# EasyEDA Pro project ProPrj_HTXStudio_OneHanded_Keyboard.epro, board 方向按键
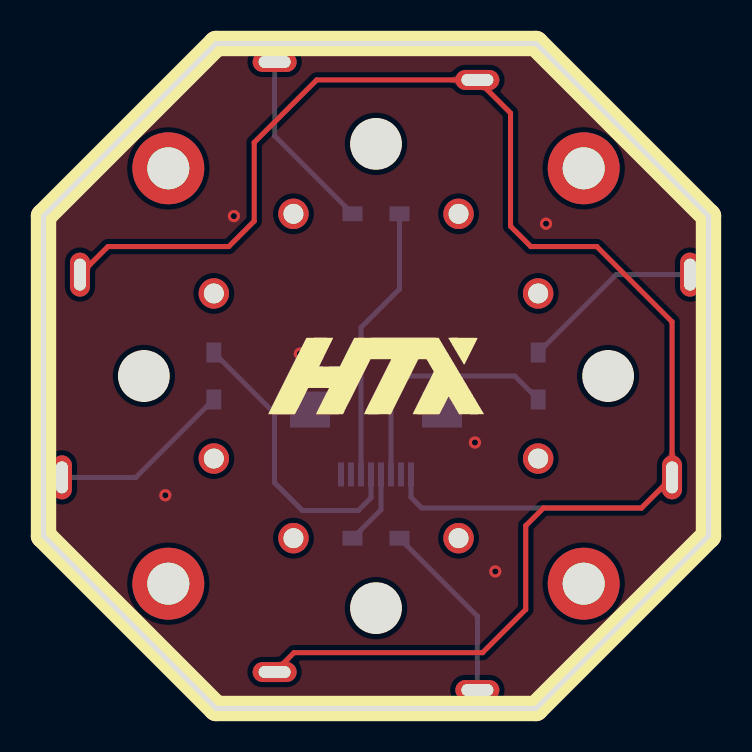
[diagram p10: board, top side]
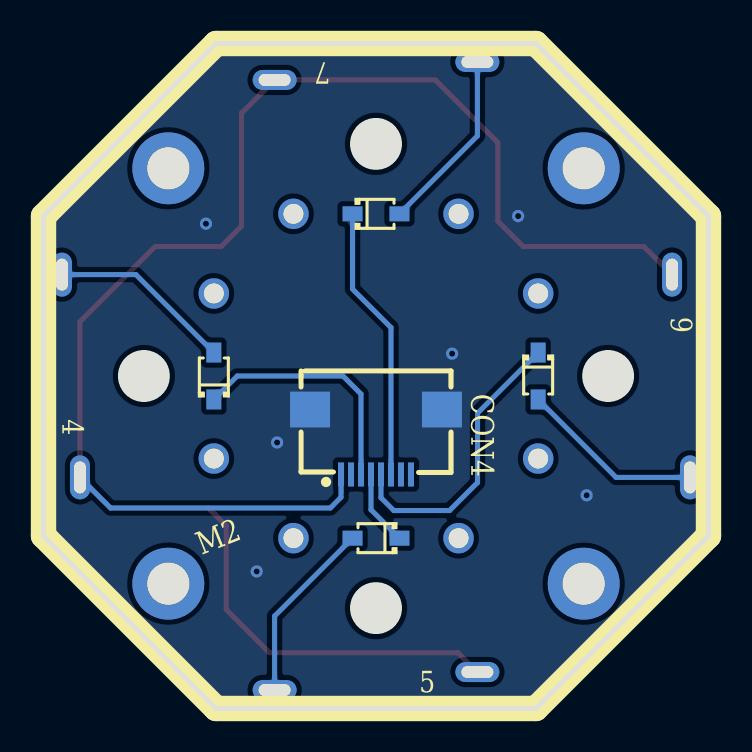
[diagram p11: board, bottom side, seen from below]

Outline 33.27 x 33.27 mm; copper layers: Top Layer, Bottom Layer. Coordinates in mm from the lower left corner of the outline.
Outline path: 0,24.64 0,8.64 8.64,0 24.64,0 33.27,8.64 33.27,24.64 24.64,33.27 8.64,33.27 0,24.64
Stack: Top Layer 0.035mm / Dielectric1 1.51mm FR4 er 4.5 / Bottom Layer 0.035mm

## Design rules (mm)
template: 自定义配置
spacing copperThickness1oz (default): track to track 0.102, other pairs 0.152 to 0.3
spacing copperThickness2oz: track to track 0.203, other pairs 0.152 to 0.3
track width copperThickness1oz (default): min 0.127, default 0.254, max 2.54
track width copperThickness2oz: min 0.203, default 0.254, max 2.54
differential pair differentialPair (default): width min 0.127, default 0.254, max 2.54; gap min 0.152, default 0.152
via viaSize (default): diameter min 0.5, default 0.61, max 10; hole min 0.3, default 0.305, max 6.3

## Placement (name value [footprint] x y rotation side)
D59  1N4148WS  [SOD-323_L1.8-W1.3-LS2.5-RD]  24.75 16.64 90 bottom
D60  1N4148WS  [SOD-323_L1.8-W1.3-LS2.5-RD]  16.64 8.52 0 bottom
D61  1N4148WS  [SOD-323_L1.8-W1.3-LS2.5-RD]  8.52 16.64 270 bottom
D62  1N4148WS  [SOD-323_L1.8-W1.3-LS2.5-RD]  16.64 24.75 180 bottom
FPC7  FPC-05FB-8PH20  [FPC-SMD_8P-P0.50_XUNPU_FPC-05FB-8PH20]  16.64 13.33 0 bottom
K18  -  [ALPS_键盘轴]  16.64 24.75 180 top
K19  -  [ALPS_键盘轴]  8.52 16.64 270 top
K20  -  [ALPS_键盘轴]  16.64 8.52 0 top
K21  -  [ALPS_键盘轴]  24.75 16.64 90 top
NOREF  -  [Pad_e52]  6.25 6.25 180 top
NOREF#2  -  [Pad_e48]  6.25 27.03 0 top
NOREF#3  -  [Pad_e53]  27.03 6.25 0 top
NOREF#4  -  [Pad_e51]  27.03 27.03 180 top

## Footprints (pads in the part's own frame, mm; a bottom-side part is the same pattern mirrored in y, then rotated)
ALPS_键盘轴
  round 1.524 hole 1: 1(-4.13,0) 1(4.13,0)
  oval 2.2x1 hole 1.6x0.6: 2(-5.073,-6.7) 3(5.073,-7.6)
FPC-SMD_8P-P0.50_XUNPU_FPC-05FB-8PH20
  rect 0.3x1.2 smd: 1(1.75,1.625) 2(1.25,1.625) 3(0.75,1.625) 4(0.25,1.625) 5(-0.25,1.625) 6(-0.75,1.625) 7(-1.25,1.625) 8(-1.75,1.625)
  rect 2x1.8 smd: 9(-3.3,-1.625) 10(3.3,-1.625)
Pad_e48
  round 3.6 hole 2.1: 1(0,0)
Pad_e51
  round 3.6 hole 2.1: 1(0,0)
Pad_e52
  round 3.6 hole 2.1: 1(0,0)
Pad_e53
  round 3.6 hole 2.1: 1(0,0)
SOD-323_L1.8-W1.3-LS2.5-RD
  rect 1x0.75 smd: 1(-1.173,0) 2(1.173,0)

## Nets
As in the schematic.

Pads without a net: K18 1; K19 1; K20 1; K21 1; NOREF 1; NOREF#2 1; NOREF#3 1; NOREF#4 1

## Via types
v1: diameter 0.61, hole 0.305, Top Layer to Bottom Layer, 6 vias

## Routing (per net, layer and track width the routed paths; a pad name or vN(x,y) marks a point on that pad's centre or on a via; arc(x,y) is an arc through that point)
GND:
  vias: v1(6.1,10.67) v1(9.53,24.64) v1(12.83,17.75) v1(21.59,13.31) v1(22.61,6.86) v1(25.15,24.26)
CCOL4: length 12.2
  Bottom Layer w0.254: FPC7.3 17.39,15.74 18.29,16.64 23.58,16.64 D59.1
CCOL5: length 3.8
  Bottom Layer w0.254: FPC7.4 16.89,9.95 D60.1
CCOL6: length 14.6
  Bottom Layer w0.254: D61.1 11.56,14.78 11.56,11.3 12.95,9.91 15.75,9.91 16.39,10.55 FPC7.5
CCOL7: length 13.8
  Bottom Layer w0.254: FPC7.6 15.89,19.06 17.81,20.98 D62.1
CROW6: length 93.5
  Top Layer w0.254: 1.82,21.71 3.23,23.11 9.27,23.11 10.54,24.38 10.54,28.32 13.67,31.45 K18.2 23.37,29.79 23.37,24.13 24.38,23.11 27.69,23.11 31.45,19.35 31.45,11.56 29.92,10.03 25.02,10.03 24.13,9.14 24.13,4.95 21.97,2.79 12.53,2.79 K20.2
  Bottom Layer w0.254: 31.45,11.56 29.92,10.03 18.92,10.03 18.39,10.57 FPC7.1
$1N260: length 9.2
  Bottom Layer w0.254: 32.35,21.71 28.65,21.71 D59.2
$1N299: length 9.2
  Bottom Layer w0.254: D60.2 21.71,4.62 K20.3
$1N338: length 9.2
  Bottom Layer w0.254: 0.92,11.56 4.62,11.56 D61.2
$1N377: length 9.2
  Bottom Layer w0.254: K18.3 11.56,28.65 D62.2

## Copper pours and planes (outline as drawn; the poured copper is in the pictures)
GND on Top Layer: 0,24.64 8.64,33.27 24.64,33.27 33.27,24.64 33.27,8.64 24.64,0 8.64,0 0,8.64
GND on Bottom Layer: 0,24.64 8.64,33.27 24.64,33.27 33.27,24.64 33.27,8.64 24.64,0 8.64,0 0,8.64

Small or netless copper shapes (teardrops, artwork), in the pictures only: 6 on Top Layer, 16 on Bottom Layer

## Text on the board
Bottom Silkscreen Layer: 5 | 4 | 7 | 6 | M2 | CON4
